# EasyEDA Pro project ProPrj_辉光管时钟V2.0_2025-10-09.epro, schematic Schematic1
Board Name: 驱动部分; Create Date: 2024-09-08; Page Name: 驱动; Project Name: 辉光管时钟V2.0; Schematic Name: Schematic1; Update Date: 2024-09-17
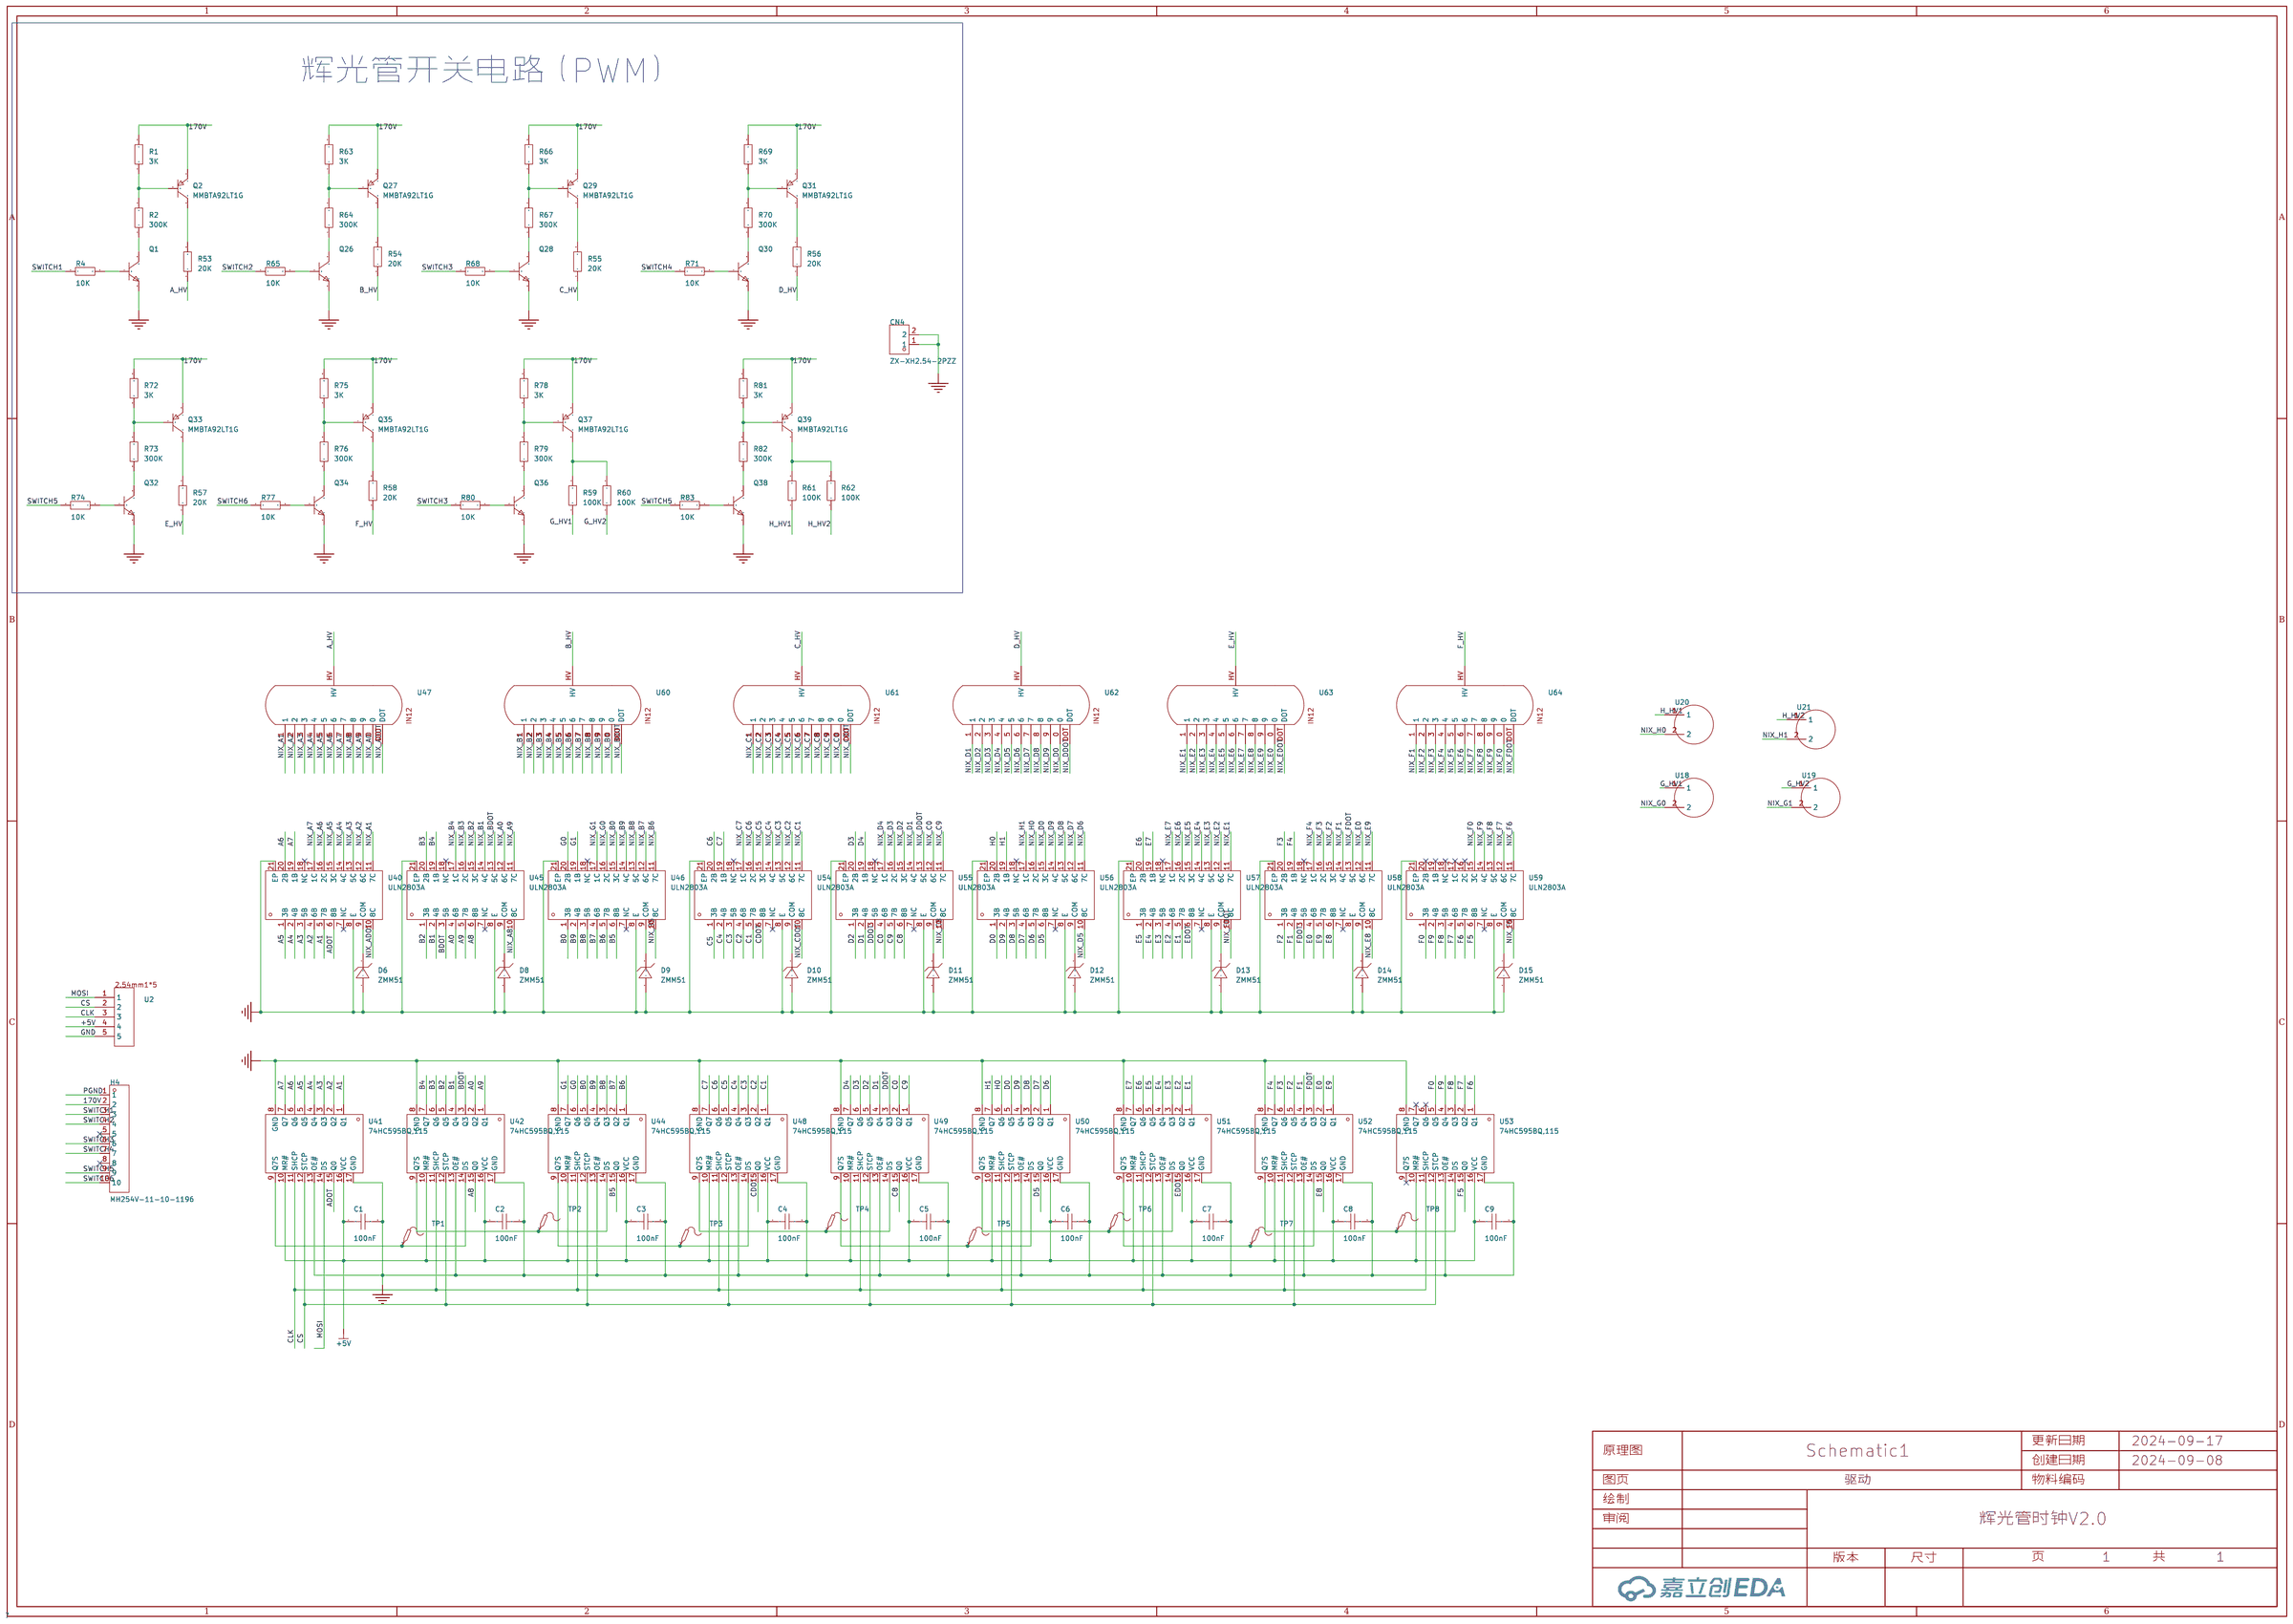
[diagram p0: schematic sheet]

## Parts
C1  100nF  [C0603]
C2  100nF  [C0603]
C3  100nF  [C0603]
C4  100nF  [C0603]
C5  100nF  [C0603]
C6  100nF  [C0603]
C7  100nF  [C0603]
C8  100nF  [C0603]
C9  100nF  [C0603]
CN4  ZX-XH2.54-2PZZ  [CONN-TH_2P-P2.50_HX25003-2A]
D6  ZMM51  [LL-34_L3.5-W1.5-RD]
D8  ZMM51  [LL-34_L3.5-W1.5-RD]
D9  ZMM51  [LL-34_L3.5-W1.5-RD]
D10  ZMM51  [LL-34_L3.5-W1.5-RD]
D11  ZMM51  [LL-34_L3.5-W1.5-RD]
D12  ZMM51  [LL-34_L3.5-W1.5-RD]
D13  ZMM51  [LL-34_L3.5-W1.5-RD]
D14  ZMM51  [LL-34_L3.5-W1.5-RD]
D15  ZMM51  [LL-34_L3.5-W1.5-RD]
H4  MH254V-11-10-1196  [HDR-TH_10P-P2.54-V-M]
Q1  MMBT5551  [SOT-23-3_L2.9-W1.3-P1.90-LS2.4-BR]
Q2  MMBTA92LT1G  [SOT-23-3_L2.9-W1.6-P1.90-LS2.8-BR]
Q26  MMBT5551  [SOT-23-3_L2.9-W1.3-P1.90-LS2.4-BR]
Q27  MMBTA92LT1G  [SOT-23-3_L2.9-W1.6-P1.90-LS2.8-BR]
Q28  MMBT5551  [SOT-23-3_L2.9-W1.3-P1.90-LS2.4-BR]
Q29  MMBTA92LT1G  [SOT-23-3_L2.9-W1.6-P1.90-LS2.8-BR]
Q30  MMBT5551  [SOT-23-3_L2.9-W1.3-P1.90-LS2.4-BR]
Q31  MMBTA92LT1G  [SOT-23-3_L2.9-W1.6-P1.90-LS2.8-BR]
Q32  MMBT5551  [SOT-23-3_L2.9-W1.3-P1.90-LS2.4-BR]
Q33  MMBTA92LT1G  [SOT-23-3_L2.9-W1.6-P1.90-LS2.8-BR]
Q34  MMBT5551  [SOT-23-3_L2.9-W1.3-P1.90-LS2.4-BR]
Q35  MMBTA92LT1G  [SOT-23-3_L2.9-W1.6-P1.90-LS2.8-BR]
Q36  MMBT5551  [SOT-23-3_L2.9-W1.3-P1.90-LS2.4-BR]
Q37  MMBTA92LT1G  [SOT-23-3_L2.9-W1.6-P1.90-LS2.8-BR]
Q38  MMBT5551  [SOT-23-3_L2.9-W1.3-P1.90-LS2.4-BR]
Q39  MMBTA92LT1G  [SOT-23-3_L2.9-W1.6-P1.90-LS2.8-BR]
R1  3K  [R0603]
R2  300K  [R0603]
R4  10K  [R0603]
R53  20K  [R0603]
R54  20K  [R0603]
R55  20K  [R0603]
R56  20K  [R0603]
R57  20K  [R0603]
R58  20K  [R0603]
R59  100K  [R0603]
R60  100K  [R0603]
R61  100K  [R0603]
R62  100K  [R0603]
R63  3K  [R0603]
R64  300K  [R0603]
R65  10K  [R0603]
R66  3K  [R0603]
R67  300K  [R0603]
R68  10K  [R0603]
R69  3K  [R0603]
R70  300K  [R0603]
R71  10K  [R0603]
R72  3K  [R0603]
R73  300K  [R0603]
R74  10K  [R0603]
R75  3K  [R0603]
R76  300K  [R0603]
R77  10K  [R0603]
R78  3K  [R0603]
R79  300K  [R0603]
R80  10K  [R0603]
R81  3K  [R0603]
R82  300K  [R0603]
R83  10K  [R0603]
TP1  -  [Test-Point-0.5mm]
TP2  -  [Test-Point-0.5mm]
TP3  -  [Test-Point-0.5mm]
TP4  -  [Test-Point-0.5mm]
TP5  -  [Test-Point-0.5mm]
TP6  -  [Test-Point-0.5mm]
TP7  -  [Test-Point-0.5mm]
TP8  -  [Test-Point-0.5mm]
U2  -  [2.54mm1*5]
U18  -  [6*13氖泡]
U19  -  [6*13氖泡]
U20  -  [6*13氖泡]
U21  -  [6*13氖泡]
U40  ULN2803A  [QFN-20_L4.0-W4.0-P0.50-BL-EP]
U41  74HC595BQ,115  [DHVQFN-16_L3.5-W2.5-P0.50-BL-EP]
U42  74HC595BQ,115  [DHVQFN-16_L3.5-W2.5-P0.50-BL-EP]
U44  74HC595BQ,115  [DHVQFN-16_L3.5-W2.5-P0.50-BL-EP]
U45  ULN2803A  [QFN-20_L4.0-W4.0-P0.50-BL-EP]
U46  ULN2803A  [QFN-20_L4.0-W4.0-P0.50-BL-EP]
U47  -  [IN12]
U48  74HC595BQ,115  [DHVQFN-16_L3.5-W2.5-P0.50-BL-EP]
U49  74HC595BQ,115  [DHVQFN-16_L3.5-W2.5-P0.50-BL-EP]
U50  74HC595BQ,115  [DHVQFN-16_L3.5-W2.5-P0.50-BL-EP]
U51  74HC595BQ,115  [DHVQFN-16_L3.5-W2.5-P0.50-BL-EP]
U52  74HC595BQ,115  [DHVQFN-16_L3.5-W2.5-P0.50-BL-EP]
U53  74HC595BQ,115  [DHVQFN-16_L3.5-W2.5-P0.50-BL-EP]
U54  ULN2803A  [QFN-20_L4.0-W4.0-P0.50-BL-EP]
U55  ULN2803A  [QFN-20_L4.0-W4.0-P0.50-BL-EP]
U56  ULN2803A  [QFN-20_L4.0-W4.0-P0.50-BL-EP]
U57  ULN2803A  [QFN-20_L4.0-W4.0-P0.50-BL-EP]
U58  ULN2803A  [QFN-20_L4.0-W4.0-P0.50-BL-EP]
U59  ULN2803A  [QFN-20_L4.0-W4.0-P0.50-BL-EP]
U60  -  [IN12]
U61  -  [IN12]
U62  -  [IN12]
U63  -  [IN12]
U64  -  [IN12]

## Library data of the parts
C1-C9 = CAP_0603: Supplier Footprint: 0603
CN4 = ZX-XH2.54-2PZZ: 插针结构:1x2P;间距:2.54mm;安装方式:直插;参考系列:XH;总PIN数:2P;排数:1;每排PIN数:2;行距:-;额定电流:3A;触头材质:黄铜;触头镀层:锡;工作温度范围:-25℃~+85℃;; Supplier Part: C7429632; Manufacturer: Megastar(兆星); Supplier Footprint: 插件,P=2.54mm; JLCPCB Part Class: Extended Part; Datasheet: https://atta.szlcsc.com/upload/public/pdf/source/20230619/19BA6947230AA44A04D3EDD65E618FD0.pdf; Supplier: LCSC; Pins Structure: 1x2P; Pitch: 2.54mm; Mounting Style: 直插; Reference Series: XH; Number of Pins: 2P; Number of Rows: 1; Number of PINs Per Row: 2; Current Rating (Max): 3A; Contact Material: 黄铜; Contact Plating: 锡; Operating Temperature Range: -25℃~+85℃
D6 D8-D15 = ZMM51: 二极管配置:独立式;稳压值(标称值):51V;稳压值(范围):48V~54V;功率:500mW;精度:-;; LCSC Part Name: ZMM51 停产; Supplier Part: C8086; Manufacturer: ST(先科); Supplier Footprint: LL-34; JLCPCB Part Class: Extended Part; Datasheet: https://atta.szlcsc.com/upload/public/pdf/source/20130822/1457706639609.pdf; Supplier: LCSC; Diode Configuration: 独立式; Zener Voltage (Nom): 51V; Reverse Leakage Current (Ir): 100nA@39V; Zener Voltage (Range): 48V~54V; Power Dissipation: 500mW; Zener Impedance (Zzt): 125Ω
H4 = MH254V-11-10-1196: LCSC Part Name: 圆孔排针2.54mm 1x10P 直插 镀金1U L=11.96mm 常规型; Supplier Part: C5184055; Manufacturer: XFCN(兴飞); Supplier Footprint: 插件,P=2.54mm; JLCPCB Part Class: 扩展库; Datasheet: https://atta.szlcsc.com/upload/public/pdf/source/20220929/9F034EF7D5273C93A87A714F13A4BC8E.pdf; Supplier: LCSC
Q1 Q26 Q28 Q30 Q32 Q34 Q36 Q38 = MMBT5551_C2145: 晶体管类型:NPN;集电极电流(Ic):600mA;集射极击穿电压(Vceo):160V;功率(Pd):300mW;直流电流增益(hFE@Ic,Vce):200@10mA,5V;; LCSC Part Name: 耐压:160V 电流:600mA NPN hfe=200~300; Supplier Part: C2145; Manufacturer: CJ(江苏长电/长晶); Supplier Footprint: SOT-23; JLCPCB Part Class: Basic Part; Datasheet: https://atta.szlcsc.com/upload/public/pdf/source/20140321/1457707027001.pdf; Supplier: LCSC; Transistor Type: NPN; Collector-Emitter Breakdown Voltage (Vceo): 160V; Collector Current (Ic): 600mA; Power Dissipation (Pd): 300mW; Collector Cut-Off Current (Icbo): 50nA; Collector-Emitter Saturation Voltage (VCE(sat)@Ic,Ib): 200mV@50mA,5mA; DC Current Gain (hFE@Ic,Vce): 200@10mA,5V; Transition Frequency (fT): 100MHz; Operating Temperature: +150℃@(Tj)
Q2 Q27 Q29 Q31 Q33 Q35 Q37 Q39 = MMBTA92LT1G: 直流电流增益(hFE@Ic,Vce):25@30mA,10V;功率(Pd):300mW;集射极击穿电压(Vceo):300V;集电极电流(Ic):500mA;晶体管类型:PNP;; LCSC Part Name: 耐压:300V 电流:500mA PNP; Supplier Part: C82049; Manufacturer: onsemi(安森美); Supplier Footprint: SOT-23; JLCPCB Part Class: 扩展库; Datasheet: https://atta.szlcsc.com/upload/public/pdf/source/20160910/1473490306913.PDF; Supplier: LCSC; DC Current Gain (hFE@Ic,Vce): 25@30mA,10V; Power Dissipation (Pd): 300mW; Transition Frequency (fT): 50MHz; Collector-Emitter Breakdown Voltage (Vceo): 300V; Collector Current (Ic): 500mA; Collector Cut-Off Current (Icbo): 250nA; Collector-Emitter Saturation Voltage (VCE(sat)@Ic,Ib): 500mV@20mA,2mA; Transistor Type: PNP; Operating Temperature: -55℃~+150℃@(Tj)
R1 R2 R4 R53-R83 = Res_0603: Supplier Footprint: 0603
TP1-TP8 = Test-Point: Test Point 测试点
U2 = 2.54mm1*5
U18-U21 = 氖泡
U40 U45 U46 U54-U59 = ULN2803A_C493377: 集电极电流(Ic):-;; Supplier Part: C493377; Manufacturer: Mixic(中科芯亿达); Supplier Footprint: QFN-20-EP(4x4); JLCPCB Part Class: Extended Part; Datasheet: https://atta.szlcsc.com/upload/public/pdf/source/20200417/C493377_96E7298976A1714D07CEFF283F4FBF93.pdf; Supplier: LCSC
U41 U42 U44 U48-U53 = 74HC595BQ,115: 功能:-;; Supplier Part: C730243; Manufacturer: Nexperia(安世); Supplier Footprint: DHVQFN-16-EP(2.5x3.5); JLCPCB Part Class: Extended Part; Datasheet: https://atta.szlcsc.com/upload/public/pdf/source/20200702/C547124_A846DA65A930A46F45C6AA18257527FF.pdf; Supplier: LCSC
U47 U60-U64 = IN12

## Nets
170V: H4.2 Q2.2(E) Q27.2(E) Q29.2(E) Q31.2(E) Q33.2(E) Q35.2(E) Q37.2(E) Q39.2(E) R1.2 R63.2 R66.2 R69.2 R72.2 R75.2 R78.2 R81.2
+5V: C1.1 C2.1 C3.1 C4.1 C5.1 C6.1 C7.1 C8.1 C9.1 U2.4 U41.10(MR#) U41.16(VCC) U42.10(MR#) U42.16(VCC) U44.10(MR#) U44.16(VCC) U48.10(MR#) U48.16(VCC) U49.10(MR#) U49.16(VCC) U50.10(MR#) U50.16(VCC) U51.10(MR#) U51.16(VCC) U52.10(MR#) U52.16(VCC) U53.10(MR#) U53.16(VCC)
GND: C1.2 C2.2 C3.2 C4.2 C5.2 C6.2 C7.2 C8.2 C9.2 U2.5 U41.8(GND) U41.13(OE#) U41.17(GND) U42.8(GND) U42.13(OE#) U42.17(GND) U44.8(GND) U44.13(OE#) U44.17(GND) U48.8(GND) U48.13(OE#) U48.17(GND) U49.8(GND) U49.13(OE#) U49.17(GND) U50.8(GND) U50.13(OE#) U50.17(GND) U51.8(GND) U51.13(OE#) U51.17(GND) U52.8(GND) U52.13(OE#) U52.17(GND) U53.8(GND) U53.13(OE#) U53.17(GND)
PGND: CN4.1 CN4.2 D6.2(A) D8.2(A) D9.2(A) D10.2(A) D11.2(A) D12.2(A) D13.2(A) D14.2(A) D15.2(A) H4.1 Q1.2(E) Q26.2(E) Q28.2(E) Q30.2(E) Q32.2(E) Q34.2(E) Q36.2(E) Q38.2(E) U40.8(E) U40.21(EP) U45.8(E) U45.21(EP) U46.8(E) U46.21(EP) U54.8(E) U54.21(EP) U55.8(E) U55.21(EP) U56.8(E) U56.21(EP) U57.8(E) U57.21(EP) U58.8(E) U58.21(EP) U59.8(E) U59.21(EP)
A0: U42.2(Q2) U45.4(6B)
A1: U40.5(7B) U41.1(Q1)
A2: U40.4(6B) U41.2(Q2)
A3: U40.3(5B) U41.3(Q3)
A4: U40.2(4B) U41.4(Q4)
A5: U40.1(3B) U41.5(Q5)
A6: U40.20(2B) U41.6(Q6)
A7: U40.19(1B) U41.7(Q7)
A8: U42.15(Q0) U45.6(8B)
A9: U42.1(Q1) U45.5(7B)
A_HV: R53.1 U47.HV
ADOT: U40.6(8B) U41.15(Q0)
B0: U44.5(Q5) U46.1(3B)
B1: U42.4(Q4) U45.2(4B)
B2: U42.5(Q5) U45.1(3B)
B3: U42.6(Q6) U45.20(2B)
B4: U42.7(Q7) U45.19(1B)
B5: U44.15(Q0) U46.6(8B)
B6: U44.1(Q1) U46.5(7B)
B7: U44.2(Q2) U46.4(6B)
B8: U44.3(Q3) U46.3(5B)
B9: U44.4(Q4) U46.2(4B)
B_HV: R54.1 U60.HV
BDOT: U42.3(Q3) U45.3(5B)
C0: U49.2(Q2) U55.4(6B)
C1: U48.1(Q1) U54.5(7B)
C2: U48.2(Q2) U54.4(6B)
C3: U48.3(Q3) U54.3(5B)
C4: U48.4(Q4) U54.2(4B)
C5: U48.5(Q5) U54.1(3B)
C6: U48.6(Q6) U54.20(2B)
C7: U48.7(Q7) U54.19(1B)
C8: U49.15(Q0) U55.6(8B)
C9: U49.1(Q1) U55.5(7B)
C_HV: R55.1 U61.HV
CDOT: U48.15(Q0) U54.6(8B)
CLK: U2.3 U41.11(SHCP) U42.11(SHCP) U44.11(SHCP) U48.11(SHCP) U49.11(SHCP) U50.11(SHCP) U51.11(SHCP) U52.11(SHCP) U53.11(SHCP)
CS: U2.2 U41.12(STCP) U42.12(STCP) U44.12(STCP) U48.12(STCP) U49.12(STCP) U50.12(STCP) U51.12(STCP) U52.12(STCP) U53.12(STCP)
D0: U50.5(Q5) U56.1(3B)
D1: U49.4(Q4) U55.2(4B)
D2: U49.5(Q5) U55.1(3B)
D3: U49.6(Q6) U55.20(2B)
D4: U49.7(Q7) U55.19(1B)
D5: U50.15(Q0) U56.6(8B)
D6: U50.1(Q1) U56.5(7B)
D7: U50.2(Q2) U56.4(6B)
D8: U50.3(Q3) U56.3(5B)
D9: U50.4(Q4) U56.2(4B)
D_HV: R56.1 U62.HV
DDOT: U49.3(Q3) U55.3(5B)
E0: U52.2(Q2) U58.4(6B)
E1: U51.1(Q1) U57.5(7B)
E2: U51.2(Q2) U57.4(6B)
E3: U51.3(Q3) U57.3(5B)
E4: U51.4(Q4) U57.2(4B)
E5: U51.5(Q5) U57.1(3B)
E6: U51.6(Q6) U57.20(2B)
E7: U51.7(Q7) U57.19(1B)
E8: U52.15(Q0) U58.6(8B)
E9: U52.1(Q1) U58.5(7B)
E_HV: R57.1 U63.HV
EDOT: U51.15(Q0) U57.6(8B)
F0: U53.5(Q5) U59.1(3B)
F1: U52.4(Q4) U58.2(4B)
F2: U52.5(Q5) U58.1(3B)
F3: U52.6(Q6) U58.20(2B)
F4: U52.7(Q7) U58.19(1B)
F5: U53.15(Q0) U59.6(8B)
F6: U53.1(Q1) U59.5(7B)
F7: U53.2(Q2) U59.4(6B)
F8: U53.3(Q3) U59.3(5B)
F9: U53.4(Q4) U59.2(4B)
F_HV: R58.1 U64.HV
FDOT: U52.3(Q3) U58.3(5B)
G0: U44.6(Q6) U46.20(2B)
G1: U44.7(Q7) U46.19(1B)
G_HV1: R59.1 U18.1
G_HV2: R60.1 U19.1
H0: U50.6(Q6) U56.20(2B)
H1: U50.7(Q7) U56.19(1B)
H_HV1: R61.1 U20.1
H_HV2: R62.1 U21.1
MOSI: U2.1 U41.14(DS)
NIX_A0: U45.12(6C) U47.0
NIX_A1: U40.11(7C) U47.1
NIX_A2: U40.12(6C) U47.2
NIX_A3: U40.13(5C) U47.3
NIX_A4: U40.14(4C) U47.4
NIX_A5: U40.15(3C) U47.5
NIX_A6: U40.16(2C) U47.6
NIX_A7: U40.17(1C) U47.7
NIX_A8: U45.10(8C) U47.8
NIX_A9: U45.11(7C) U47.9
NIX_ADOT: U40.10(8C) U47.DOT
NIX_B0: U46.15(3C) U60.0
NIX_B1: U45.14(4C) U60.1
NIX_B2: U45.15(3C) U60.2
NIX_B3: U45.16(2C) U60.3
NIX_B4: U45.17(1C) U60.4
NIX_B5: U46.10(8C) U60.5
NIX_B6: U46.11(7C) U60.6
NIX_B7: U46.12(6C) U60.7
NIX_B8: U46.13(5C) U60.8
NIX_B9: U46.14(4C) U60.9
NIX_BDOT: U45.13(5C) U60.DOT
NIX_C0: U55.12(6C) U61.0
NIX_C1: U54.11(7C) U61.1
NIX_C2: U54.12(6C) U61.2
NIX_C3: U54.13(5C) U61.3
NIX_C4: U54.14(4C) U61.4
NIX_C5: U54.15(3C) U61.5
NIX_C6: U54.16(2C) U61.6
NIX_C7: U54.17(1C) U61.7
NIX_C8: U55.10(8C) U61.8
NIX_C9: U55.11(7C) U61.9
NIX_CDOT: U54.10(8C) U61.DOT
NIX_D0: U56.15(3C) U62.0
NIX_D1: U55.14(4C) U62.1
NIX_D2: U55.15(3C) U62.2
NIX_D3: U55.16(2C) U62.3
NIX_D4: U55.17(1C) U62.4
NIX_D5: U56.10(8C) U62.5
NIX_D6: U56.11(7C) U62.6
NIX_D7: U56.12(6C) U62.7
NIX_D8: U56.13(5C) U62.8
NIX_D9: U56.14(4C) U62.9
NIX_DDOT: U55.13(5C) U62.DOT
NIX_E0: U58.12(6C) U63.0
NIX_E1: U57.11(7C) U63.1
NIX_E2: U57.12(6C) U63.2
NIX_E3: U57.13(5C) U63.3
NIX_E4: U57.14(4C) U63.4
NIX_E5: U57.15(3C) U63.5
NIX_E6: U57.16(2C) U63.6
NIX_E7: U57.17(1C) U63.7
NIX_E8: U58.10(8C) U63.8
NIX_E9: U58.11(7C) U63.9
NIX_EDOT: U57.10(8C) U63.DOT
NIX_F0: U59.15(3C) U64.0
NIX_F1: U58.14(4C) U64.1
NIX_F2: U58.15(3C) U64.2
NIX_F3: U58.16(2C) U64.3
NIX_F4: U58.17(1C) U64.4
NIX_F5: U59.10(8C) U64.5
NIX_F6: U59.11(7C) U64.6
NIX_F7: U59.12(6C) U64.7
NIX_F8: U59.13(5C) U64.8
NIX_F9: U59.14(4C) U64.9
NIX_FDOT: U58.13(5C) U64.DOT
NIX_G0: U18.2 U46.16(2C)
NIX_G1: U19.2 U46.17(1C)
NIX_H0: U20.2 U56.16(2C)
NIX_H1: U21.2 U56.17(1C)
SWITCH1: H4.3 R4.1
SWITCH2: H4.4 R65.1
SWITCH3: H4.6 R68.1 R80.1
SWITCH4: H4.7 R71.1
SWITCH5: H4.9 R74.1 R83.1
SWITCH6: H4.10 R77.1
$1N13394: TP1.1 U41.9(Q7S) U42.14(DS)
$1N13396: TP2.1 U42.9(Q7S) U44.14(DS)
$1N13403: D6.1(C) U40.9(COM)
$1N13404: D8.1(C) U45.9(COM)
$1N13405: D9.1(C) U46.9(COM)
$1N13668: D10.1(C) U54.9(COM)
$1N13669: D11.1(C) U55.9(COM)
$1N13670: D12.1(C) U56.9(COM)
$1N13767: D13.1(C) U57.9(COM)
$1N13768: D14.1(C) U58.9(COM)
$1N13769: D15.1(C) U59.9(COM)
$1N13978: TP3.1 U44.9(Q7S) U48.14(DS)
$1N13979: TP4.1 U48.9(Q7S) U49.14(DS)
$1N13980: TP5.1 U49.9(Q7S) U50.14(DS)
$1N13981: TP6.1 U50.9(Q7S) U51.14(DS)
$1N13982: TP7.1 U51.9(Q7S) U52.14(DS)
$1N13983: TP8.1 U52.9(Q7S) U53.14(DS)
$1N27497: Q1.3(C) R2.1
$1N27498: Q1.1(B) R4.2
$1N27501: Q2.1(B) R1.1 R2.2
$1N27676: Q26.3(C) R64.1
$1N27677: Q26.1(B) R65.2
$1N27680: Q27.1(B) R63.1 R64.2
$1N27855: Q28.3(C) R67.1
$1N27856: Q28.1(B) R68.2
$1N27859: Q29.1(B) R66.1 R67.2
$1N28034: Q30.3(C) R70.1
$1N28035: Q30.1(B) R71.2
$1N28038: Q31.1(B) R69.1 R70.2
$1N28072: Q27.3(C) R54.2
$1N28104: Q29.3(C) R55.2
$1N28136: Q31.3(C) R56.2
$1N28168: Q2.3(C) R53.2
$1N28942: Q32.3(C) R73.1
$1N28943: Q32.1(B) R74.2
$1N28946: Q33.1(B) R72.1 R73.2
$1N28950: Q34.3(C) R76.1
$1N28951: Q34.1(B) R77.2
$1N28954: Q35.1(B) R75.1 R76.2
$1N28958: Q36.3(C) R79.1
$1N28959: Q36.1(B) R80.2
$1N28962: Q37.1(B) R78.1 R79.2
$1N28966: Q38.3(C) R82.1
$1N28967: Q38.1(B) R83.2
$1N28970: Q39.1(B) R81.1 R82.2
$1N28974: Q35.3(C) R58.2
$1N28989: Q33.3(C) R57.2
$1N29050: Q37.3(C) R59.2 R60.2
$1N29111: Q39.3(C) R61.2 R62.2

Not connected (* = marked no-connect by the designer): H4 5* 8*; U40 7(NC)* 18(NC)*; U45 7(NC)* 18(NC)*; U46 7(NC)* 18(NC)*; U53 6(Q6)* 7(Q7)* 9(Q7S)*; U54 7(NC)* 18(NC)*; U55 7(NC)* 18(NC)*; U56 7(NC)* 18(NC)*; U57 7(NC)* 18(NC)*; U58 7(NC)* 18(NC)*; U59 7(NC)* 16(2C)* 17(1C)* 18(NC)* 19(1B)* 20(2B)*

## Notes on the sheet
- 辉光管开关电路（PWM）
